# Altium project soldering.PrjPcb
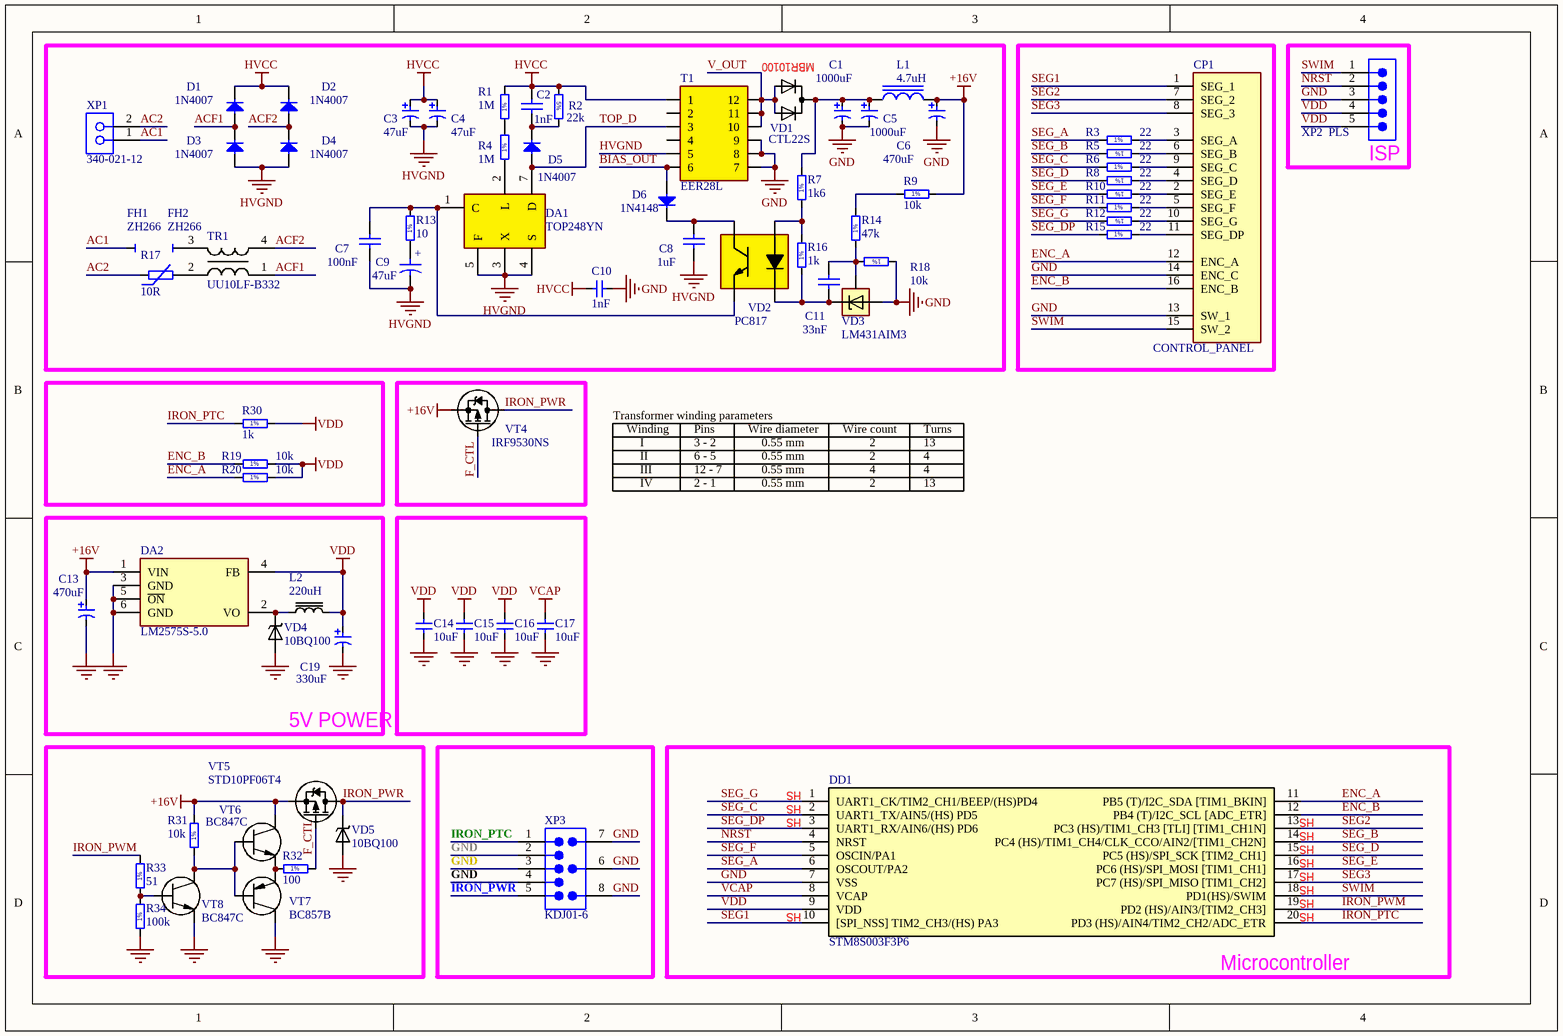
[diagram p0: soldering.SchDoc]
1 sheet, 71 parts. Net scope: global (net labels, ports and power ports of the same name join across sheets).
Board file: soldering.PcbDoc

## Sheet soldering.SchDoc
size A4

### Parts
C1  1000uF  [CAP_EL_13_20_VERT]
C2  1nF  [CAPR500-250X720X650]
C3  47uF  [CAP_EL_16_25_LEFT]
C4  47uF  [CAP_EL_16_25_LEFT]
C5  1000uF  [CAP_EL_13_20_VERT]
C6  470uF  [CAP_EL_10_19_VERT]
C7  100nF  [CAPRR508-350X500X500]
C8  1uF  [CAPRR508-508X762X914]
C9  47uF  [CAPPR350-800X1150]
C10  1nF  [CAP_7MM_Y]
C11  33nF  [CAPRR254-318X508X660]
C13  470uF  [CAP_EL_10_19_VERT]
C14  10uF  [CAP0805R]
C15  10uF  [CAP0805R]
C16  10uF  [CAP0805R]
C17  10uF  [CAP0805R]
C19  330uF  [TAN_D]
CP1  CONTROL_PANEL  [CONTROL_PANEL]
D1  1N4007  [DO-41]
D2  1N4007  [DO-41]
D3  1N4007  [DO-41]
D4  1N4007  [DO-41]
D5  1N4007  [DO-41]
D6  1N4148  [DO-35]
DA1  TOP248YN  [TO-220-7]
DA2  LM2575S-5.0  [TO-263-5]
DD1  8 Bit MCU  [TSSOP20]  (value not drawn)
FH1  ZH266  [ZH266]
FH2  ZH266  [ZH266]
L1  4.7uH  [SL1016]
L2  220uH  [SDR1005]
R1  1M  [RES_AXIAL_0_25_8]
R2  22k  [RESADV508-1670X520]
R3  22  [RES0805R]
R4  1M  [RES_AXIAL_0_25_8]
R5  22  [RES0805R]
R6  22  [RES0805R]
R7  1k6  [RES_AXIAL_0_25_8]
R8  22  [RES0805R]
R9  10k  [RES_AXIAL_0_25_8]
R10  22  [RES0805R]
R11  22  [RES0805R]
R12  22  [RES0805R]
R13  10  [RES_AXIAL_0_25_8]
R14  47k  [RES_AXIAL_0_25_8]
R15  22  [RES0805R]
R16  1k  [RES_AXIAL_0_25_8]
R17  10R  [B57164K]
R18  10k  [RES_AXIAL_0_25_8]
R19  10k  [RES0805R]
R20  10k  [RES0805R]
R30  1k  [RES0805R]
R31  10k  [RES0805R]
R32  100  [RES0805R]
R33  51  [RES0805R]
R34  100k  [RES0805R]
T1  EER28L  [EER28L]
TR1  PartNumber: UU10LF-B332  [CG00008A]  (hidden comment: 22mH)
VD1  CTL22S  [TO-220-3]
VD2  PC817  [DIP4]
VD3  LM431AIM3  [TO92]
VD4  10BQ100  [DO-214AA]
VD5  10BQ100  [DO-214AA]
VT4  IRF9530NS  [D2PAK]
VT5  STD10PF06T4  [DPAK]
VT6  BC847C  [SOT23]
VT7  BC857B  [SOT23]
VT8  BC847C  [SOT23]
XP1  340-021-12  [340-021-12]
XP2  PLS  [PLS-05]
XP3  KDJ01-6  [KDJ01-6]

### Blocks framed on the sheet
MBR10100: C1-C11 D1-D6 DA1 FH1 FH2 L1 R1 R2 R4 R7 R9 R13 R14 R16-R18 T1 TR1 VD1-VD3 XP1
ISP: XP2
5V POWER: C13 C19 DA2 L2 VD4
Microcontroller: DD1

### Nets
+16V: C6.2 C13.2 DA2.1(VIN) L1.2 R9.2 R31.2 VT4.2(S) VT5.2(S) VT6.3(C)
GND: C1.1 C5.1 C6.1 C10.2 C13.1 C14.1 C15.1 C16.1 C17.1 C19.1 CP1.13(SW_1) CP1.14(ENC_C) DA2.3(GND) DA2.5(~{ON}) DA2.6(GND) DD1.7(VSS) R18.1 R34.1 T1.7 T1.8 T1.9 VD3.2(A) VD4.A VD5.A VT7.3(C) VT8.2(E) XP2.3 XP3.2 XP3.3 XP3.4 XP3.6 XP3.7 XP3.8
HVCC: C2.2 C3.2 C4.2 C10.1 D1.1(C) D2.1(C) R1.2 R2.1 T1.1
HVGND: C3.1 C4.1 C7.2 C8.1 C9.2 D3.2(A) D4.2(A) DA1.3(X) DA1.4(S) DA1.5(F) T1.5
VCAP: C17.2 DD1.8(VCAP)
VDD: C14.2 C15.2 C16.2 C19.2 DA2.4(FB) DD1.9(VDD) L2.2 R19.2 R20.2 R30.2 XP2.4 XP2.5
AC1: FH1.1 XP1.1
AC2: R17.1 XP1.2
ACF1: D1.2(A) D3.1(C) TR1.1
ACF2: D2.2(A) D4.1(C) TR1.4
BIAS_OUT: D6.2(A) T1.6
ENC_A: CP1.12(ENC_A) DD1.11(PB5_(T)/I2C_SDA_[TIM1_BKIN]) R20.1
ENC_B: CP1.16(ENC_B) DD1.12(PB4_(T)/I2C_SCL_[ADC_ETR]) R19.1
F_CTL: R32.2 VT4.1(G) VT5.1(G)
IRON_PTC: DD1.20(PD3_(HS)/AIN4/TIM2_CH2/ADC_ETR) R30.1 XP3.1
IRON_PWM: DD1.19(PD2_(HS)/AIN3/[TIM2_CH3]) R33.2
IRON_PWR: VD5.K VT4.3(D) VT5.3(D) XP3.5
NRST: DD1.4(NRST) XP2.2
SEG1: CP1.1(SEG_1) DD1.10([SPI_NSS]_TIM2_CH3/(HS)_PA3)
SEG2: CP1.7(SEG_2) DD1.13(PC3_(HS)/TIM1_CH3_[TLI]_[TIM1_CH1N])
SEG3: CP1.8(SEG_3) DD1.17(PC7_(HS)/SPI_MISO_[TIM1_CH2])
SEG_A: DD1.6(OSCOUT/PA2) R3.1
SEG_B: DD1.14(PC4_(HS)/TIM1_CH4/CLK_CCO/AIN2/[TIM1_CH2N]) R5.2
SEG_C: DD1.2(UART1_TX/AIN5/(HS)_PD5) R6.1
SEG_D: DD1.15(PC5_(HS)/SPI_SCK_[TIM2_CH1]) R8.2
SEG_DP: DD1.3(UART1_RX/AIN6/(HS)_PD6) R15.1
SEG_E: DD1.16(PC6_(HS)/SPI_MOSI_[TIM1_CH1]) R10.2
SEG_F: DD1.5(OSCIN/PA1) R11.1
SEG_G: DD1.1(UART1_CK/TIM2_CH1/BEEP/(HS)PD4) R12.2
SWIM: CP1.15(SW_2) DD1.18(PD1(HS)/SWIM) XP2.1
TOP_D: D5.2(A) DA1.7(D) T1.3
V_OUT: T1.10 T1.11 T1.12 VD1.1(A) VD1.3(A)
NetC1_2: C1.2 C5.2 L1.1 R7.2 VD1.2(K)
NetC2_1: C2.1 D5.1(C) R2.2
NetC7_1: C7.1 DA1.1(C) R13.2 VD2.3(E)
NetC8_2: C8.2 D6.1(C) VD2.4(C)
NetC9_1: C9.1 R13.1
NetC11_1: C11.1 R14.1 R18.2 VD3.3(REF)
NetC11_2: C11.2 R16.1 VD2.2(K) VD3.1(K)
NetCP1_2: CP1.2(SEG_E) R10.1
NetCP1_3: CP1.3(SEG_A) R3.2
NetCP1_4: CP1.4(SEG_D) R8.1
NetCP1_5: CP1.5(SEG_F) R11.2
NetCP1_6: CP1.6(SEG_B) R5.1
NetCP1_9: CP1.9(SEG_C) R6.2
NetCP1_10: CP1.10(SEG_G) R12.1
NetCP1_11: CP1.11(SEG_DP) R15.2
NetDA1_2: DA1.2(L) R4.1
NetDA2_2: DA2.2(VO) L2.1 VD4.K
NetFH2_1: FH2.1 TR1.3
NetR1_1: R1.1 R4.2
NetR7_1: R7.1 R16.2 VD2.1(A)
NetR9_1: R9.1 R14.2
NetR17_2: R17.2 TR1.2
NetR31_1: R31.1 VT6.1(B) VT7.1(B) VT8.3(C)
NetR32_1: R32.1 VT6.2(E) VT7.2(E)
NetR33_1: R33.1 R34.2 VT8.1(B)

Not connected (* = marked no-connect by the designer): T1 2 4

### Notes on the sheet
- Transformer winding parameters
- Winding
- I
- Pins
- 3 - 2
- Wire diameter
- 0.55 mm
- Wire count
- 2
- Turns
- 13
- II
- III
- IV
- 6 - 5
- 12 - 7
- 2 - 1
- 4
- (near DD1) HS
- (in symbol CAER_47UF_63V_20%_350-800X1150) +
- (in symbol R0805_1K_1%_0.125W_100PPM) 1%
- (in symbol R0805_10K_1%_0.125W_100PPM) 1%
- (in symbol R0805_22R_1%_0.125W_100PPM) 1%
- (in symbol R0805_51R_1%_0.125W_100PPM) 1%
- (in symbol R0805_100K_1%_0.125W_100PPM) 1%
- (in symbol R0805_100R_1%_0.125W_100PPM) 1%
- (in symbol RMF_1K6_1%_0.6W_50PPM_1016-630X250) 1%
- (in symbol RMF_1K_1%_0.6W_50PPM_1016-630X250) 1%
- (in symbol RMF_1M_1%_0.6W_50PPM_1016-630X250) 1%
- (in symbol RMF_10K_1%_0.6W_50PPM_1016-630X250) 1%
- (in symbol RMF_10R_1%_0.6W_50PPM_1016-630X250) 1%
- (in symbol RMF_22K_5%_3W_250PPM_508-1670X520_v) 5%
- (in symbol RMF_47K_1%_0.6W_50PPM_1016-630X250) 1%

### Library data of the parts
C1 C5 = SK035M1000B5S-1320 (VERT MOUNTED): Voltage: 35V; Table: Electrolytic THD; Part Number: SK035M1000B5S-1320 (VERT MOUNTED); Value: 1000uF
C2 = CPER_1NF_63V_10%_500-250X720X650: Non-polarised capacitor; Part Description: Metallized Polyester Film Capacitor (MKT); Manufacturer: EPCOS; Manufacturer Part Number: B32529C0102K000; Voltage: 63VDC/40VAC; Tolerance: ±10%; Table: Capacitors THD; Part Number: CPER_1NF_63V_10%_500-250X720X650; Component Kind: Standard; Component Type: Standard; Pin Count: 2; Value: 1nF; Status: None; Case: LS5 W2.5 x L7.2 x H6.5; Mounted: Yes; Socket: No; SMD: No; ComponentHeight: 6.5mm; HelpURL: \\cern.ch\dfs\Applications\Altium\Datasheets\CPER_EPCOS_B32529.pdf; Author: CERN DEM JLC; CreateDate: 19.12.2007; LatestRevisionDate: 19.12.2007
C3 C4 = SH400M0047B7F-1625 (LEFT MOUNTED): Voltage: 400V; Table: Electrolytic THD; Part Number: SH400M0047B7F-1625 (LEFT MOUNTED); Value: 47uF
C6 = SJ035M0470B5S-1019 (VERT MOUNTED): Voltage: 35V; Table: Electrolytic THD; Part Number: SJ035M0470B5S-1019 (VERT MOUNTED); Value: 470uF
C7 = CCR_100NF_50V_10%_X7R_508-350X500X500: Non-polarised capacitor; Part Description: Radial Lead Type Monolithic Ceramic Capacitor; Manufacturer: MURATA; Manufacturer Part Number: RPER71H104K2M1A03A; Voltage: 50VDC; TC: X7R; Tolerance: ±10%; Table: Capacitors THD; Part Number: CCR_100NF_50V_10%_X7R_508-350X500X500; Component Kind: Standard; Component Type: Standard; Pin Count: 2; Value: 100nF; Status: Preferred; Case: LS5.08 W3.5 x L5 x H5; Mounted: Yes; Socket: No; SMD: No; ComponentHeight: 5.0mm; HelpURL: \\cern.ch\dfs\Applications\Altium\Datasheets\CCR_MURATA_RPE.pdf; Author: CERN DEM JLC; CreateDate: 28.01.2008; LatestRevisionDate: 24.08.2009
C8 = CCR_1UF_50V_10%_X7R_508-508X762X914: Non-polarised capacitor; Part Description: Radial Lead Type Multilayer Ceramic Capacitor; Manufacturer: KEMET; Manufacturer Part Number: C330C105K5R5TA; Voltage: 50VDC; TC: X7R; Tolerance: ±10%; Table: Capacitors THD; Part Number: CCR_1UF_50V_10%_X7R_508-508X762X914; Component Kind: Standard; Component Type: Standard; Pin Count: 2; Value: 1uF; Status: Preferred; Case: LS5.08 W5.08 x L7.62 x H9.14; Mounted: Yes; Socket: No; SMD: No; ComponentHeight: 9.14mm; HelpURL: \\cern.ch\dfs\Applications\Altium\Datasheets\CCR_KEMET_C330.pdf; Author: CERN DEM JLC; CreateDate: 28.01.2008; LatestRevisionDate: 28.01.2008
C9 = CAER_47UF_63V_20%_350-800X1150: Polarised capacitor; Part Description: Aluminum Electrolytic Capacitor; Manufacturer: GENERIC; Manufacturer1 Part Number: EEUFC1J470; Voltage: 63V; Tolerance: ±20%; Table: Capacitors THD; Part Number: CAER_47UF_63V_20%_350-800X1150; Component Kind: Standard; Component Type: Standard; Pin Count: 2; Value: 47uF; Status: Preferred; Manufacturer Part Number: CAER_47UF_63V_20%_350-800X1150; Case: LS3.5 D8 x H11.5; Mounted: Yes; Socket: No; SMD: No; ComponentHeight: 11.5mm; Manufacturer1 Example: PANASONIC; Manufacturer1 ComponentHeight: 11.5mm; HelpURL: \\cern.ch\dfs\Applications\Altium\Datasheets\CAER_PANASONIC_FC.pdf; Author: CERN DEM JLC; CreateDate: 18.12.2007; LatestRevisionDate: 18.12.2007
C10 = VKO102KCQTC0KR: SMD 0805 Capacitor; Voltage: 1000V; Table: Ceramic THD; Part Number: VKO102KCQTC0KR; Value: 1nF
C11 = CCR_33NF_100V_10%_X7R_254-318X508X660: Non-polarised capacitor; Part Description: Radial Lead Type Multilayer Ceramic Capacitor; Manufacturer: GENERIC; Manufacturer1 Part Number: SR201C333KTR; Voltage: 100VDC; TC: X7R; Tolerance: ±10%; Table: Capacitors THD; Part Number: CCR_33NF_100V_10%_X7R_254-318X508X660; Component Kind: Standard; Component Type: Standard; Pin Count: 2; Value: 33nF; Status: Preferred; Manufacturer Part Number: CCR_33NF_100V_10%_X7R_254-318X508X660; Case: LS2.54 W3.18 x L5.08 x H6.6; Mounted: Yes; Socket: No; SMD: No; ComponentHeight: 6.6mm; Manufacturer1 Example: AVX; Manufacturer1 ComponentHeight: 6.6mm; HelpURL: \\cern.ch\dfs\Applications\Altium\Datasheets\CCR_AVX_SR20.pdf; Author: CERN DEM JLC; CreateDate: 30.01.2008; LatestRevisionDate: 24.08.2009
C13 = SH050M0470B5S-1019 (VERT MOUNTED): Voltage: 50V; Table: Electrolytic THD; Part Number: SH050M0470B5S-1019 (VERT MOUNTED); Value: 470uF
C14-C17 = CC0805_10UF_10V_10%_X7R: SMD 0805 Capacitor; Part Description: SMD Multilayer Chip Ceramic Capacitor; Manufacturer: GENERIC; Manufacturer1 Part Number: GRM21BR71A106KE51L; Voltage: 10V; TC: X7R; Tolerance: ±10%; Table: Capacitors SMD; Part Number: CC0805_10UF_10V_10%_X7R; Component Kind: Standard; Component Type: Standard; Pin Count: 2; Value: 10uF; Status: Preferred; Manufacturer Part Number: CC0805_10UF_10V_10%_X7R; Case: 0805; Mounted: Yes; Socket: No; SMD: Yes; Manufacturer1 Example: MURATA; Manufacturer1 ComponentHeight: 1.35mm; HelpURL: \\cern.ch\dfs\Applications\Altium\Datasheets\CC0805_X7R_MURATA.pdf; Author: I. Kuznetsov; CreateDate: 30.04.2012; LatestRevisionDate: 30.04.2012
C19 = T495D337M010AHE100: Voltage: 10V; Table: Tantalum; Part Number: T495D337M010AHE100; Value: 330uF
D1-D5 = 1N4007: Diode; Part Description: Axial Lead Standard Recovery Rectifier; Manufacturer: FAIRCHILD SEMICONDUCTOR; Voltage: 1000V; Power: 1A; Table: Diodes; Part Number: 1N4007; Component Kind: Standard; Component Type: Standard; Device: 1N4007; PackageDescription: DO-41, Diode, Axial, Body 4.7 x 2.7mm (LxDia. Max), Pin spacing 10.16mm; Manufacturer Part Number: 1N4007; Pin Count: 2; Case: DO-41; Mounted: Yes; Socket: No; SMD: No; ComponentHeight: 2.72mm; HelpURL: \\cern.ch\dfs\Applications\Altium\Datasheets\1N4007.pdf; ComponentLink1URL: \\cern.ch\dfs\Applications\Altium\Datasheets\1N4007_Package.pdf; ComponentLink1Description: Package Drawing; Author: CERN DEM JLC; CreateDate: 20.08.2008; LatestRevisionDate: 30.10.2013
D6 = 1N4148: Diode; Part Description: High-Speed Diode; Manufacturer: NXP SEMICONDUCTORS; Voltage: 100V; Power: 200mA; Table: Diodes; Part Number: 1N4148; Component Kind: Standard; Component Type: Standard; Device: 1N4148; PackageDescription: DO-35, Diode, Axial, Body 4.6 x 2mm (LxDia. max), Pin spacing 7.62mm; Manufacturer Part Number: 1N4148; Pin Count: 2; Case: DO-35; Mounted: Yes; Socket: No; SMD: No; ComponentHeight: 1.85mm; HelpURL: \\cern.ch\dfs\Applications\Altium\Datasheets\1N4148.pdf; Author: CERN DEM JLC; CreateDate: 24.05.2012; LatestRevisionDate: 24.05.2012
DA1 = TOP248YN: Table: Power; Part Number: TOP248YN; Device: TOP248YN
DA2 = LM2575S-5.0: Manufacturer: TI; Table: Regulators; Part Number: LM2575S-5.0; Component Kind: Standard; Component Type: Standard; Device: LM2575S-5.0; Status: Active; Manufacturer Part Number: LM2575S-5.0; Pin Count: 6; Case: TO-263-5; Mounted: Yes; Socket: No; SMD: Yes; Author: I. Kuznetsov
DD1 = STM8S003F3P6: 8 Bit MCU (STmicroelectronics); PartNumber: STM8S003F3P6
FH1 FH2 = ZH266: Table: OTHER; Part Number: ZH266; Family: ZH266; Device: ZH266
L1 = SL1016-4R7K 4.7: Table: Inductors THD; Part Number: SL1016-4R7K 4.7; Value: 4.7uH
L2 = SDR1005-221KL: Table: SMD; Part Number: SDR1005-221KL; Value: 220uH
R1 R4 = RMF_1M_1%_0.6W_50PPM_1016-630X250: Part Description: Leaded Metal Film Resistor; Manufacturer: GENERIC; Manufacturer1 Part Number: MBB02070C1004FCT00; Power: 0.6W; TC: ±50ppm/°C; Tolerance: ±1%; Table: THD; Part Number: RMF_1M_1%_0.6W_50PPM_1016-630X250; Component Kind: Standard; Component Type: Standard; Pin Count: 2; Value: 1M; Status: Preferred; Manufacturer Part Number: RMF_1M_1%_0.6W_50PPM_1016-630X250; Case: LS10.16 L6.3 x D2.5; Mounted: Yes; Socket: No; SMD: No; ComponentHeight: 2.5mm; Manufacturer1 Example: VISHAY BEYSCHLAG; Manufacturer1 ComponentHeight: 2.5mm; HelpURL: \\cern.ch\dfs\Applications\Altium\Datasheets\RMF_VISHAY_MBB0207.pdf; Author: CERN DEM JLC; CreateDate: 04.12.2007; LatestRevisionDate: 07.04.2008
R2 = RMF_22K_5%_3W_250PPM_508-1670X520_v: Resistor - 5%; Part Description: Leaded Power Metal Film Resistor (Vertical Mount) PR03 Series; Manufacturer: GENERIC; Manufacturer1 Part Number: PR03000202202JAC00; Power: 3W; TC: ±250ppm/°C; Table: Resistors THD; Part Number: RMF_22K_5%_3W_250PPM_508-1670X520_v; Component Kind: Standard; Component Type: Standard; Pin Count: 2; Value: 22k; Status: Preferred; Tolerance: ±5%; Manufacturer Part Number: RMF_22K_5%_3W_250PPM_508-1670X520; Case: LS5.08 L16.7 x D5.2; Mounted: Yes; Socket: No; SMD: No; ComponentHeight: 23.6mm; Manufacturer1 Example: VISHAY BCCOMPONENT; Manufacturer1 ComponentHeight: 23.6mm; HelpURL: \\cern.ch\dfs\Applications\Altium\Datasheets\RMF_VISHAY_PR03.pdf; Author: CERN DEM JLC; CreateDate: 18.11.2011; LatestRevisionDate: 01.10.2012
R3 R5 R6 R8 R10-R12 R15 = R0805_22R_1%_0.125W_100PPM: Part Description: General Purpose Thick Film Chip Resistor; Manufacturer: GENERIC; Manufacturer1 Part Number: NRC10F22R0TRF; Power: 0.125W; TC: ±100ppm/°C; Tolerance: ±1%; Table: Resistors SMD; Part Number: R0805_22R_1%_0.125W_100PPM; Component Kind: Standard; Component Type: Standard; Footprint: RESC2012X60N; Pin Count: 2; Value: 22; Status: Preferred; Manufacturer Part Number: R0805_22R_1%_0.125W_100PPM; Case: 0805; Mounted: Yes; Socket: No; SMD: Yes; Manufacturer1 Example: NIC COMPONENT; Manufacturer1 ComponentHeight: 0.6mm; HelpURL: \\cern.ch\dfs\Applications\Altium\Datasheets\R0805_NIC_NRC.pdf; Author: CERN DEM JLC; CreateDate: 03.12.2007; LatestRevisionDate: 13.03.2008
R7 = RMF_1K6_1%_0.6W_50PPM_1016-630X250: Part Description: Leaded Metal Film Resistor; Manufacturer: GENERIC; Manufacturer1 Part Number: MBB02070C1601FCT00; Power: 0.6W; TC: ±50ppm/°C; Tolerance: ±1%; Table: THD; Part Number: RMF_1K6_1%_0.6W_50PPM_1016-630X250; Component Kind: Standard; Component Type: Standard; Pin Count: 2; Value: 1k6; Status: Preferred; Manufacturer Part Number: RMF_1K6_1%_0.6W_50PPM_1016-630X250; Case: LS10.16 L6.3 x D2.5; Mounted: Yes; Socket: No; SMD: No; ComponentHeight: 2.5mm; Manufacturer1 Example: VISHAY BEYSCHLAG; Manufacturer1 ComponentHeight: 2.5mm; HelpURL: \\cern.ch\dfs\Applications\Altium\Datasheets\RMF_VISHAY_MBB0207.pdf; Author: CERN DEM JLC; CreateDate: 04.12.2007; LatestRevisionDate: 07.04.2008
R9 R18 = RMF_10K_1%_0.6W_50PPM_1016-630X250: Part Description: Leaded Metal Film Resistor; Manufacturer: GENERIC; Manufacturer1 Part Number: MBB02070C1002FCT00; Power: 0.6W; TC: ±50ppm/°C; Tolerance: ±1%; Table: THD; Part Number: RMF_10K_1%_0.6W_50PPM_1016-630X250; Component Kind: Standard; Component Type: Standard; Pin Count: 2; Value: 10k; Status: Preferred; Manufacturer Part Number: RMF_10K_1%_0.6W_50PPM_1016-630X250; Case: LS10.16 L6.3 x D2.5; Mounted: Yes; Socket: No; SMD: No; ComponentHeight: 2.5mm; Manufacturer1 Example: VISHAY BEYSCHLAG; Manufacturer1 ComponentHeight: 2.5mm; HelpURL: \\cern.ch\dfs\Applications\Altium\Datasheets\RMF_VISHAY_MBB0207.pdf; Author: CERN DEM JLC; CreateDate: 04.12.2007; LatestRevisionDate: 07.04.2008
R13 = RMF_10R_1%_0.6W_50PPM_1016-630X250: Part Description: Leaded Metal Film Resistor; Manufacturer: GENERIC; Manufacturer1 Part Number: MBB02070C1009FCT00; Power: 0.6W; TC: ±50ppm/°C; Tolerance: ±1%; Table: Resistors THD; Part Number: RMF_10R_1%_0.6W_50PPM_1016-630X250; Component Kind: Standard; Component Type: Standard; Pin Count: 2; Value: 10; Status: Preferred; Manufacturer Part Number: RMF_10R_1%_0.6W_50PPM_1016-630X250; Case: LS10.16 L6.3 x D2.5; Mounted: Yes; Socket: No; SMD: No; ComponentHeight: 2.5mm; Manufacturer1 Example: VISHAY BEYSCHLAG; Manufacturer1 ComponentHeight: 2.5mm; HelpURL: \\cern.ch\dfs\Applications\Altium\Datasheets\RMF_VISHAY_MBB0207.pdf; Author: CERN DEM JLC; CreateDate: 04.12.2007; LatestRevisionDate: 07.04.2008
R14 = RMF_47K_1%_0.6W_50PPM_1016-630X250: Part Description: Leaded Metal Film Resistor; Manufacturer: GENERIC; Manufacturer1 Part Number: MBB02070C4702FCT00; Power: 0.6W; TC: ±50ppm/°C; Tolerance: ±1%; Table: THD; Part Number: RMF_47K_1%_0.6W_50PPM_1016-630X250; Component Kind: Standard; Component Type: Standard; Pin Count: 2; Value: 47k; Status: Preferred; Manufacturer Part Number: RMF_47K_1%_0.6W_50PPM_1016-630X250; Case: LS10.16 L6.3 x D2.5; Mounted: Yes; Socket: No; SMD: No; ComponentHeight: 2.5mm; Manufacturer1 Example: VISHAY BEYSCHLAG; Manufacturer1 ComponentHeight: 2.5mm; HelpURL: \\cern.ch\dfs\Applications\Altium\Datasheets\RMF_VISHAY_MBB0207.pdf; Author: CERN DEM JLC; CreateDate: 04.12.2007; LatestRevisionDate: 07.04.2008
R16 = RMF_1K_1%_0.6W_50PPM_1016-630X250: Part Description: Leaded Metal Film Resistor; Manufacturer: GENERIC; Manufacturer1 Part Number: MBB02070C1001FCT00; Power: 0.6W; TC: ±50ppm/°C; Tolerance: ±1%; Table: THD; Part Number: RMF_1K_1%_0.6W_50PPM_1016-630X250; Component Kind: Standard; Component Type: Standard; Pin Count: 2; Value: 1k; Status: Preferred; Manufacturer Part Number: RMF_1K_1%_0.6W_50PPM_1016-630X250; Case: LS10.16 L6.3 x D2.5; Mounted: Yes; Socket: No; SMD: No; ComponentHeight: 2.5mm; Manufacturer1 Example: VISHAY BEYSCHLAG; Manufacturer1 ComponentHeight: 2.5mm; HelpURL: \\cern.ch\dfs\Applications\Altium\Datasheets\RMF_VISHAY_MBB0207.pdf; Author: CERN DEM JLC; CreateDate: 04.12.2007; LatestRevisionDate: 07.04.2008
R17 = B57164K: Table: NTC; Part Number: B57164K; Value: 10R
R19 R20 R31 = R0805_10K_1%_0.125W_100PPM: Part Description: General Purpose Thick Film Chip Resistor; Manufacturer: GENERIC; Manufacturer1 Part Number: NRC10F1002TRF; Power: 0.125W; TC: ±100ppm/°C; Tolerance: ±1%; Table: Resistors SMD; Part Number: R0805_10K_1%_0.125W_100PPM; Component Kind: Standard; Component Type: Standard; Footprint: RESC2012X60N; Pin Count: 2; Value: 10k; Status: Preferred; Manufacturer Part Number: R0805_10K_1%_0.125W_100PPM; Case: 0805; Mounted: Yes; Socket: No; SMD: Yes; Manufacturer1 Example: NIC COMPONENT; Manufacturer1 ComponentHeight: 0.6mm; HelpURL: \\cern.ch\dfs\Applications\Altium\Datasheets\R0805_NIC_NRC.pdf; Author: CERN DEM JLC; CreateDate: 03.12.2007; LatestRevisionDate: 13.03.2008
R30 = R0805_1K_1%_0.125W_100PPM: Part Description: General Purpose Thick Film Chip Resistor; Manufacturer: GENERIC; Manufacturer1 Part Number: NRC10F1001TRF; Power: 0.125W; TC: ±100ppm/°C; Tolerance: ±1%; Table: Resistors SMD; Part Number: R0805_1K_1%_0.125W_100PPM; Component Kind: Standard; Component Type: Standard; Footprint: RESC2012X60N; Pin Count: 2; Value: 1k; Status: Preferred; Manufacturer Part Number: R0805_1K_1%_0.125W_100PPM; Case: 0805; Mounted: Yes; Socket: No; SMD: Yes; Manufacturer1 Example: NIC COMPONENT; Manufacturer1 ComponentHeight: 0.6mm; HelpURL: \\cern.ch\dfs\Applications\Altium\Datasheets\R0805_NIC_NRC.pdf; Author: CERN DEM JLC; CreateDate: 03.12.2007; LatestRevisionDate: 13.03.2008
R32 = R0805_100R_1%_0.125W_100PPM: Part Description: General Purpose Thick Film Chip Resistor; Manufacturer: GENERIC; Manufacturer1 Part Number: NRC10F4700TRF; Power: 0.125W; TC: ±100ppm/°C; Tolerance: ±1%; Table: Resistors SMD; Part Number: R0805_100R_1%_0.125W_100PPM; Component Kind: Standard; Component Type: Standard; Footprint: RESC2012X60N; Pin Count: 2; Value: 100; Status: Preferred; Manufacturer Part Number: R0805_100R_1%_0.125W_100PPM; Case: 0805; Mounted: Yes; Socket: No; SMD: Yes; Manufacturer1 Example: NIC COMPONENT; Manufacturer1 ComponentHeight: 0.6mm; HelpURL: \\cern.ch\dfs\Applications\Altium\Datasheets\R0805_NIC_NRC.pdf; Author: CERN DEM JLC; CreateDate: 03.12.2007; LatestRevisionDate: 13.03.2008
R33 = R0805_51R_1%_0.125W_100PPM: Part Description: General Purpose Thick Film Chip Resistor; Manufacturer: GENERIC; Manufacturer1 Part Number: NRC10F51R0TRF; Power: 0.125W; TC: ±100ppm/°C; Tolerance: ±1%; Table: Resistors SMD; Part Number: R0805_51R_1%_0.125W_100PPM; Component Kind: Standard; Component Type: Standard; Footprint: RESC2012X60N; Pin Count: 2; Value: 51; Status: Preferred; Manufacturer Part Number: R0805_51R_1%_0.125W_100PPM; Case: 0805; Mounted: Yes; Socket: No; SMD: Yes; Manufacturer1 Example: NIC COMPONENT; Manufacturer1 ComponentHeight: 0.6mm; HelpURL: \\cern.ch\dfs\Applications\Altium\Datasheets\R0805_NIC_NRC.pdf; Author: CERN DEM JLC; CreateDate: 03.12.2007; LatestRevisionDate: 13.03.2008
R34 = R0805_100K_1%_0.125W_100PPM: Part Description: General Purpose Thick Film Chip Resistor; Manufacturer: GENERIC; Manufacturer1 Part Number: NRC10F1003TRF; Power: 0.125W; TC: ±100ppm/°C; Tolerance: ±1%; Table: Resistors SMD; Part Number: R0805_100K_1%_0.125W_100PPM; Component Kind: Standard; Component Type: Standard; Footprint: RESC2012X60N; Pin Count: 2; Value: 100k; Status: Preferred; Manufacturer Part Number: R0805_100K_1%_0.125W_100PPM; Case: 0805; Mounted: Yes; Socket: No; SMD: Yes; Manufacturer1 Example: NIC COMPONENT; Manufacturer1 ComponentHeight: 0.6mm; HelpURL: \\cern.ch\dfs\Applications\Altium\Datasheets\R0805_NIC_NRC.pdf; Author: CERN DEM JLC; CreateDate: 03.12.2007; LatestRevisionDate: 13.03.2008
T1 = EER28L: Table: Cores; Part Number: EER28L; Value: EER28L
TR1 = CG00008A: Table: Inductors THD; Part Number: CG00008A; Value: 22mH
VD1 = CTL22S: Table: Diode; Part Number: CTL22S; Device: CTL22S
VD2 = PC817: Table: Optocouplers; Part Number: PC817; Device: PC817
VD3 = LM431AIM3: Table: Diode; Part Number: LM431AIM3; Device: LM431AIM3
VD4 VD5 = 10BQ100: Manufacturer: IR; Table: Diode; Part Number: 10BQ100; Component Kind: Standard; Component Type: Standard; Device: 10BQ100; Footprint: SMB; Status: Active; Manufacturer Part Number: 10BQ100; Pin Count: 2; Case: SMB; Mounted: Yes; Socket: No; SMD: Yes; Author: I. Kuznetsov
VT4 = IRF9530NS: Part Description: MOSFET P-канал 100В/14А/79Вт/0.2 Ом; Table: Transistors; Part Number: IRF9530NS; Device: IRF9530NS
VT5 = STD10PF06T4: Part Description: MOSFET P-канал 60В/10А/40Вт/0.032 Ом; Table: Transistors; Part Number: STD10PF06T4; Device: STD10PF06T4; Case: DPAK; Author: I. Kuznetsov
VT6 VT8 = BC847C: Part Description: NPN 45В/0.1А Кус.=420-800; Table: Transistors; Part Number: BC847C; Component Kind: Standard; Component Type: Standard; Device: BC847C; Status: Active; Case: SOT23; Mounted: Yes; Socket: No; SMD: Yes; Author: I. Kuznetsov
VT7 = BC857B: Part Description: PNP 45В/0.1А Кус.=200-450; Table: Transistors; Part Number: BC857B; Component Kind: Standard; Component Type: Standard; Device: BC857B; Status: Active; Case: SOT23; Mounted: Yes; Socket: No; SMD: Yes; Author: I. Kuznetsov
XP1 = 340-021-12: Table: DEGSON; Part Number: 340-021-12; Family: DG340; Device: 340-021-12
XP2 = PLS-05: Manufacturer: AUK; Part Number: PLS-05; Component Kind: Standard; Component Type: Standard; PackageDescription: PLS-05; Pin Count: 5; Family: PLS; SMD: Yes; Manufacturer Part Number: PLS-05; Table: AUK
XP3 = KDJ01-6: Table: OTHER; Part Number: KDJ01-6; Family: KDJ01-6; Device: KDJ01-6

## Assembly variants
VAR1: not fitted VT1